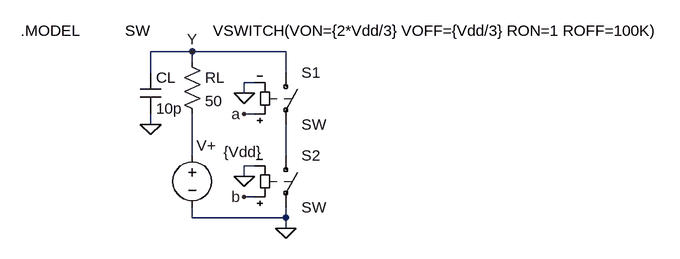
[diagram p0: schematic Nand.asc]
Nand.asc, the LTspice schematic file:
Version 4
SHEET 1 936 680
WIRE 48 112 -16 112
WIRE 192 112 48 112
WIRE 48 128 48 112
WIRE -16 144 -16 112
WIRE 192 144 192 112
WIRE 144 160 128 160
WIRE 128 176 128 160
WIRE 144 208 128 208
WIRE -16 224 -16 208
WIRE 48 272 48 208
WIRE 192 272 192 224
WIRE 144 288 128 288
WIRE 128 304 128 288
WIRE 144 336 128 336
WIRE 48 368 48 352
WIRE 192 368 192 352
WIRE 192 368 48 368
WIRE 192 384 192 368
FLAG 48 112 Y
FLAG -16 224 0
FLAG 128 176 0
FLAG 128 208 a
FLAG 192 384 0
FLAG 128 336 b
FLAG 128 304 0
SYMBOL res 32 112 R0
SYMATTR InstName RL
SYMATTR Value 50
SYMBOL cap -32 144 R0
SYMATTR InstName CL
SYMATTR Value 10p
SYMBOL sw 192 128 R0
SYMATTR InstName S1
SYMBOL sw 192 256 R0
SYMATTR InstName S2
SYMBOL voltage 48 256 R0
WINDOW 0 7 1 Left 0
WINDOW 3 48 11 Left 0
SYMATTR InstName V+
SYMATTR Value {Vdd}
TEXT -216 80 Left 0 !.MODEL          SW              VSWITCH(VON={2*Vdd/3} VOFF={Vdd/3} RON=1 ROFF=100K)

The netlist it stands for:
* Nand.asc
RL Y N001 50
CL Y 0 10p
S1 Y N002 a 0 SW
S2 N002 0 b 0 SW
V+ N001 0 {Vdd}
.MODEL          SW              VSWITCH(VON={2*Vdd/3} VOFF={Vdd/3} RON=1 ROFF=100K)
.backanno
.end